# EAGLE design 2020-03-18 Buck Regulator (EAGLE 8.6.3)

## Sheet 1 of 4: Connectors
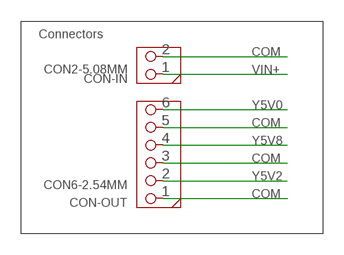
[diagram p0: schematic, sheet 1]

### Parts
CON-IN  CON2-5.08MM  [CON2-508]
CON-OUT  CON6-2.54MM  [CON6]

### Nets
COM: CON-IN.2 CON-OUT.1 CON-OUT.3 CON-OUT.5 ; also sheet 2,3,4
VIN+: CON-IN.1 ; also sheet 2
Y5V0: CON-OUT.6 ; also sheet 2,4
Y5V2: CON-OUT.2 ; also sheet 2,3
Y5V8: CON-OUT.4 ; also sheet 2,3,4

### Notes on the sheet
- Connectors

## Sheet 2 of 4: Protections
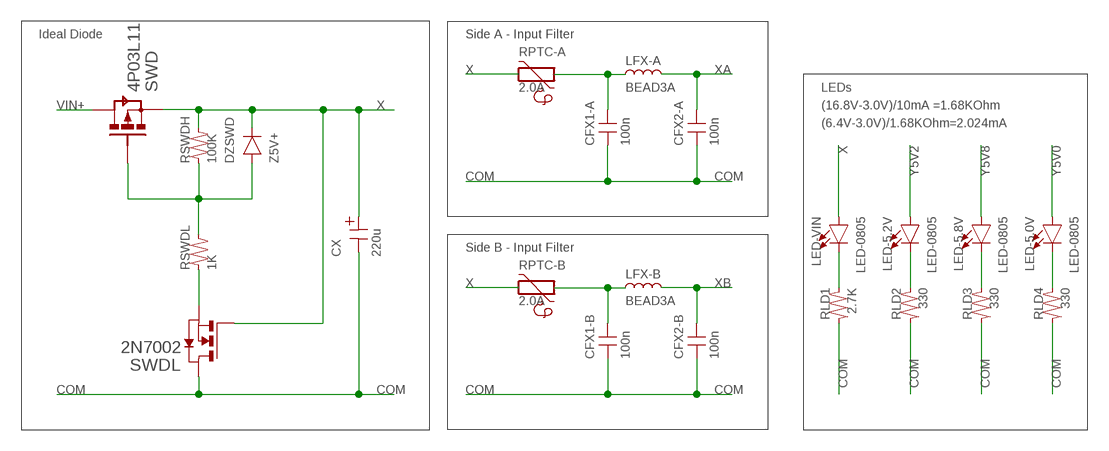
[diagram p1: schematic, sheet 2]

### Parts
CFX1-A  100n  C-0805  [SMD0805]
CFX1-B  100n  C-0805  [SMD0805]
CFX2-A  100n  C-0805  [SMD0805]
CFX2-B  100n  C-0805  [SMD0805]
CX  220u  C-POL-5.5MM  [CPOL-5MM5]
DZSWD  Z5V+  D-0805  [SMD0805-POL]
LED-5.0V  LED-0805  [SMD0805-POL]
LED-5.2V  LED-0805  [SMD0805-POL]
LED-5.8V  LED-0805  [SMD0805-POL]
LED-VIN  LED-0805  [SMD0805-POL]
LFX-A  BEAD3A  L-2.0X1.6  [SMD2MM0X1MM60]
LFX-B  BEAD3A  L-2.0X1.6  [SMD2MM0X1MM60]
RLD1  2.7K  R  [SMD0805]
RLD2  330  R  [SMD0805]
RLD3  330  R  [SMD0805]
RLD4  330  R  [SMD0805]
RPTC-A  2.0A  PTC-SMD0805  [M0805]
RPTC-B  2.0A  PTC-SMD0805  [M0805]
RSWDH  100K  R  [SMD0805]
RSWDL  1K  R  [SMD0805]
SWD  4P03L11  PMOSTO252  [TO252]
SWDL  2N7002  NMOS-SOT23  [SOT23]

### Nets
COM: CFX1-A.2 CFX1-B.2 CFX2-A.2 CFX2-B.2 CX.- RLD1.2 RLD2.2 RLD3.2 RLD4.2 SWDL.3(D) ; also sheet 1,3,4
N$1: CFX1-A.1 LFX-A.1 RPTC-A.2
N$2: DZSWD.+ RSWDH.1 RSWDL.2 SWD.1(G)
N$5: RSWDL.1 SWDL.2(S)
N$7: LED-VIN.- RLD1.1
N$8: LED-5.2V.- RLD2.1
N$10: LED-5.8V.- RLD3.1
N$11: LED-5.0V.- RLD4.1
N$13: CFX1-B.1 LFX-B.1 RPTC-B.2
VIN+: SWD.3(D) ; also sheet 1
X: CX.+ DZSWD.- LED-VIN.+ RPTC-A.1 RPTC-B.1 RSWDH.2 SWD.2(S) SWDL.1(G)
XA: CFX2-A.1 LFX-A.2 ; also sheet 3
XB: CFX2-B.1 LFX-B.2 ; also sheet 3
Y5V0: LED-5.0V.+ ; also sheet 1,4
Y5V2: LED-5.2V.+ ; also sheet 1,3
Y5V8: LED-5.8V.+ ; also sheet 1,3,4

### Notes on the sheet
- Ideal Diode | Side A - Input Filter
- LEDs
- (16.8V-3.0V)/10mA =1.68KOhm
- (6.4V-3.0V)/1.68KOhm=2.024mA
- Side B - Input Filter

## Sheet 3 of 4: Buck Regulator
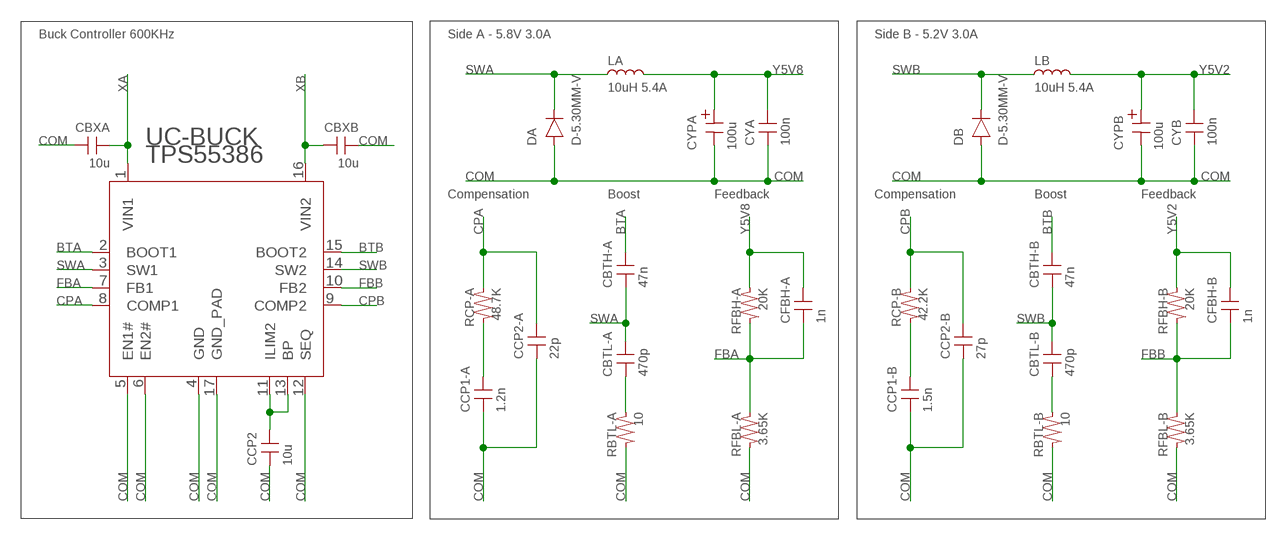
[diagram p2: schematic, sheet 3]

### Parts
CBTH-A  47n  C-0805  [SMD0805]
CBTH-B  47n  C-0805  [SMD0805]
CBTL-A  470p  C-0805  [SMD0805]
CBTL-B  470p  C-0805  [SMD0805]
CBXA  10u  C-1206  [SMD3MM2X1MM60]
CBXB  10u  C-1206  [SMD3MM2X1MM60]
CCP1-A  1.2n  C-0805  [SMD0805]
CCP1-B  1.5n  C-0805  [SMD0805]
CCP2  10u  C-1206  [SMD3MM2X1MM60]
CCP2-A  22p  C-0805  [SMD0805]
CCP2-B  27p  C-0805  [SMD0805]
CFBH-A  1n  C-0805  [SMD0805]
CFBH-B  1n  C-0805  [SMD0805]
CYA  100n  C-0805  [SMD0805]
CYB  100n  C-0805  [SMD0805]
CYPA  100u  C-POL-5.5MM  [CPOL-5MM5]
CYPB  100u  C-POL-5.5MM  [CPOL-5MM5]
DA  D-5.30MM-V  [THV-5MM30]
DB  D-5.30MM-V  [THV-5MM30]
LA  10uH 5.4A  L-12.8X12.8  [SMD12MM8X12MM8]
LB  10uH 5.4A  L-12.8X12.8  [SMD12MM8X12MM8]
RBTL-A  10  R  [SMD0805]
RBTL-B  10  R  [SMD0805]
RCP-A  48.7K  R  [SMD0805]
RCP-B  42.2K  R  [SMD0805]
RFBH-A  20K  R  [SMD0805]
RFBH-B  20K  R  [SMD0805]
RFBL-A  3.65K  R  [SMD0805]
RFBL-B  3.65K  R  [SMD0805]
UC-BUCK  TPS55386  [HTSSOP16]

### Nets
BTA: CBTH-A.1 UC-BUCK.2(BOOT1)
BTB: CBTH-B.1 UC-BUCK.15(BOOT2)
COM: CBXA.1 CBXB.2 CCP1-A.2 CCP1-B.2 CCP2-A.2 CCP2-B.2 CCP2.2 CYA.2 CYB.2 CYPA.- CYPB.- DA.+ DB.+ RBTL-A.2 RBTL-B.2 RFBL-A.2 RFBL-B.2 UC-BUCK.4(GND) UC-BUCK.5(EN1#) UC-BUCK.6(EN2#) UC-BUCK.12(SEQ) UC-BUCK.17(GND_PAD) ; also sheet 1,2,4
CPA: CCP2-A.1 RCP-A.1 UC-BUCK.8(COMP1)
CPB: CCP2-B.1 RCP-B.1 UC-BUCK.9(COMP2)
FBA: CFBH-A.2 RFBH-A.2 RFBL-A.1 UC-BUCK.7(FB1)
FBB: CFBH-B.2 RFBH-B.2 RFBL-B.1 UC-BUCK.10(FB2)
N$3: CBTL-A.2 RBTL-A.1
N$6: CCP2.1 UC-BUCK.11(ILIM2) UC-BUCK.13(BP)
N$9: CCP1-A.1 RCP-A.2
N$14: CCP1-B.1 RCP-B.2
N$15: CBTL-B.2 RBTL-B.1
SWA: CBTH-A.2 CBTL-A.1 DA.- LA.1 UC-BUCK.3(SW1)
SWB: CBTH-B.2 CBTL-B.1 DB.- LB.1 UC-BUCK.14(SW2)
XA: CBXA.2 UC-BUCK.1(VIN1) ; also sheet 2
XB: CBXB.1 UC-BUCK.16(VIN2) ; also sheet 2
Y5V2: CFBH-B.1 CYB.1 CYPB.+ LB.2 RFBH-B.1 ; also sheet 1,2
Y5V8: CFBH-A.1 CYA.1 CYPA.+ LA.2 RFBH-A.1 ; also sheet 1,2,4

### Notes on the sheet
- Buck Controller 600KHz | Side A - 5.8V 3.0A | Side B - 5.2V 3.0A
- Compensation | Boost | Feedback | Compensation | Boost | Feedback

## Sheet 4 of 4: LDO
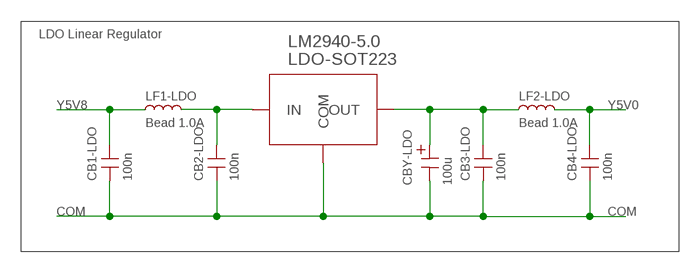
[diagram p3: schematic, sheet 4]

### Parts
CB1-LDO  100n  C-0805  [SMD0805]
CB2-LDO  100n  C-0805  [SMD0805]
CB3-LDO  100n  C-0805  [SMD0805]
CB4-LDO  100n  C-0805  [SMD0805]
CBY-LDO  100u  C-POL-5.5MM  [CPOL-5MM5]
LF1-LDO  Bead 1.0A  L-0805  [SMD0805]
LF2-LDO  Bead 1.0A  L-0805  [SMD0805]
LM2940-5.0  LDO-SOT223  [SOT223]

### Nets
COM: CB1-LDO.2 CB2-LDO.2 CB3-LDO.2 CB4-LDO.2 CBY-LDO.- LM2940-5.0.2(COM) LM2940-5.0.4(COM) ; also sheet 1,2,3
N$4: CB3-LDO.1 CBY-LDO.+ LF2-LDO.1 LM2940-5.0.3(OUT)
N$12: CB2-LDO.1 LF1-LDO.2 LM2940-5.0.1(IN)
Y5V0: CB4-LDO.1 LF2-LDO.2 ; also sheet 1,2
Y5V8: CB1-LDO.1 LF1-LDO.1 ; also sheet 1,2,3

### Notes on the sheet
- LDO Linear Regulator

## Library data of the parts
CB1-LDO CB2-LDO CB3-LDO CB4-LDO CBTH-A CBTH-B CBTL-A CBTL-B CBXA CBXB CCP1-A CCP1-B CCP2 CCP2-A CCP2-B CFBH-A CFBH-B CFX1-A CFX1-B CFX2-A CFX2-B CYA CYB = 2020-03-18-Lib:C: Standard Capacitor Non polarized capacitor
CBY-LDO CX CYPA CYPB = 2020-03-18-Lib:C-POL: Standard Polarized Capacitor
CON-IN = 2020-03-18-Lib:CON2: 2 pin screw connector
CON-OUT = 2020-03-18-Lib:CON6: Standard Connector 3 pin
DA DB DZSWD = 2020-03-18-Lib:D: Standard Diode Polarized Packages: >0805
LA LB LF1-LDO LF2-LDO LFX-A LFX-B = 2020-03-18-Lib:L: Standard Inductor
LED-5.0V LED-5.2V LED-5.8V LED-VIN = 2020-03-18-Lib:LED: Standard LED SMD0805 Polarized Package
LM2940-5.0 = 2020-03-18-Lib:LDO: LDO Three pins low dropout positive linear regulator Components: >LM2940
RBTL-A RBTL-B RCP-A RCP-B RFBH-A RFBH-B RFBL-A RFBL-B RLD1-RLD4 RSWDH RSWDL = 2020-03-18-Lib:R: Standard Resistor
RPTC-A RPTC-B = 2020-03-18-Lib:PTC: PTC Positive temperature coefficient resistor Resettable Fuse
SWD = 2020-03-18-Lib:PMOS
SWDL = 2020-03-18-Lib:NMOS: Standard NMOS
UC-BUCK = 2020-03-18-Lib:TPS55386: TPS55386 Dual Buck Regulator Number of channels: 2 Output current: 3A per channel Max Input voltage: 28V Frequency: 600KHz

## Net classes
0 default: clearance 0.2 mm

## Board
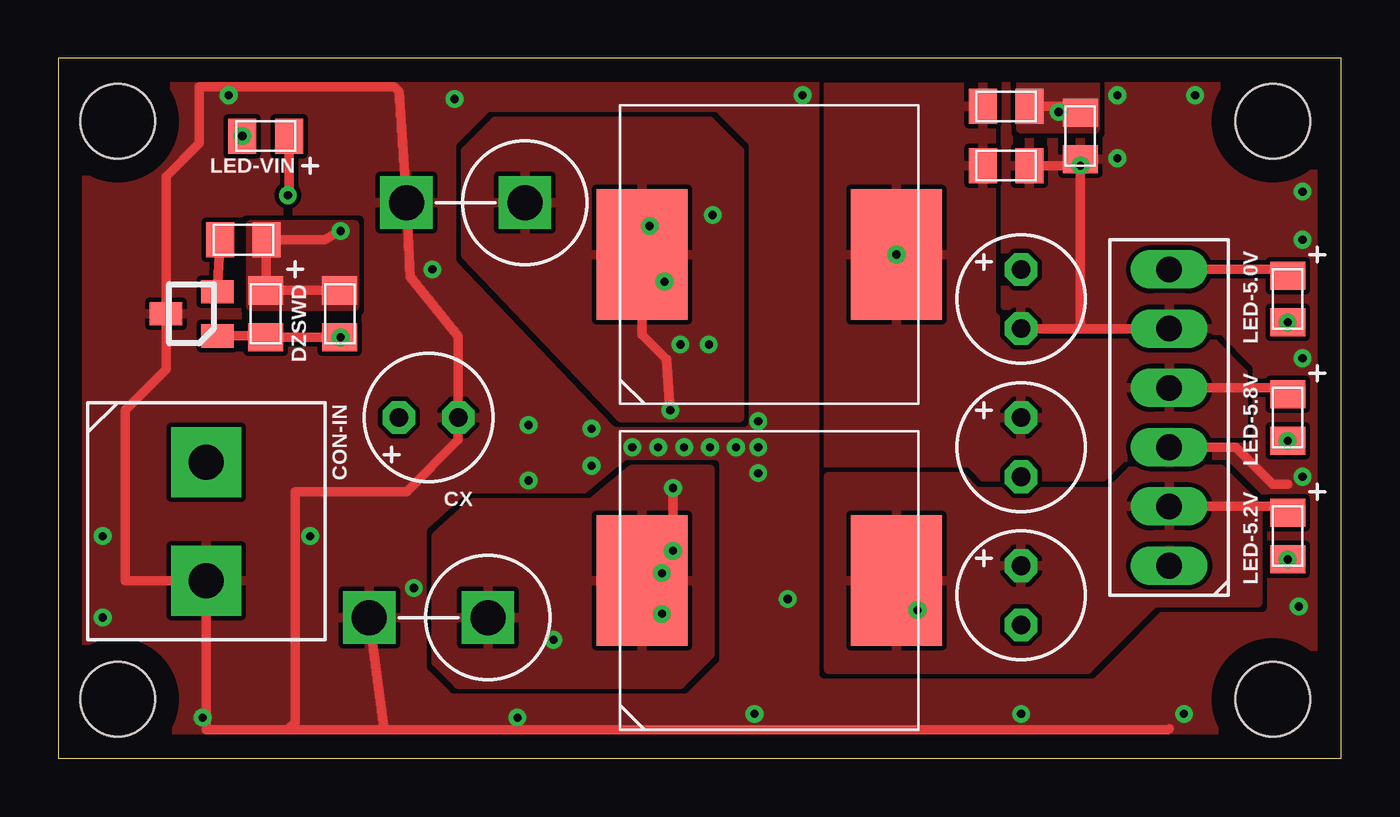
[diagram p4: board, top side]
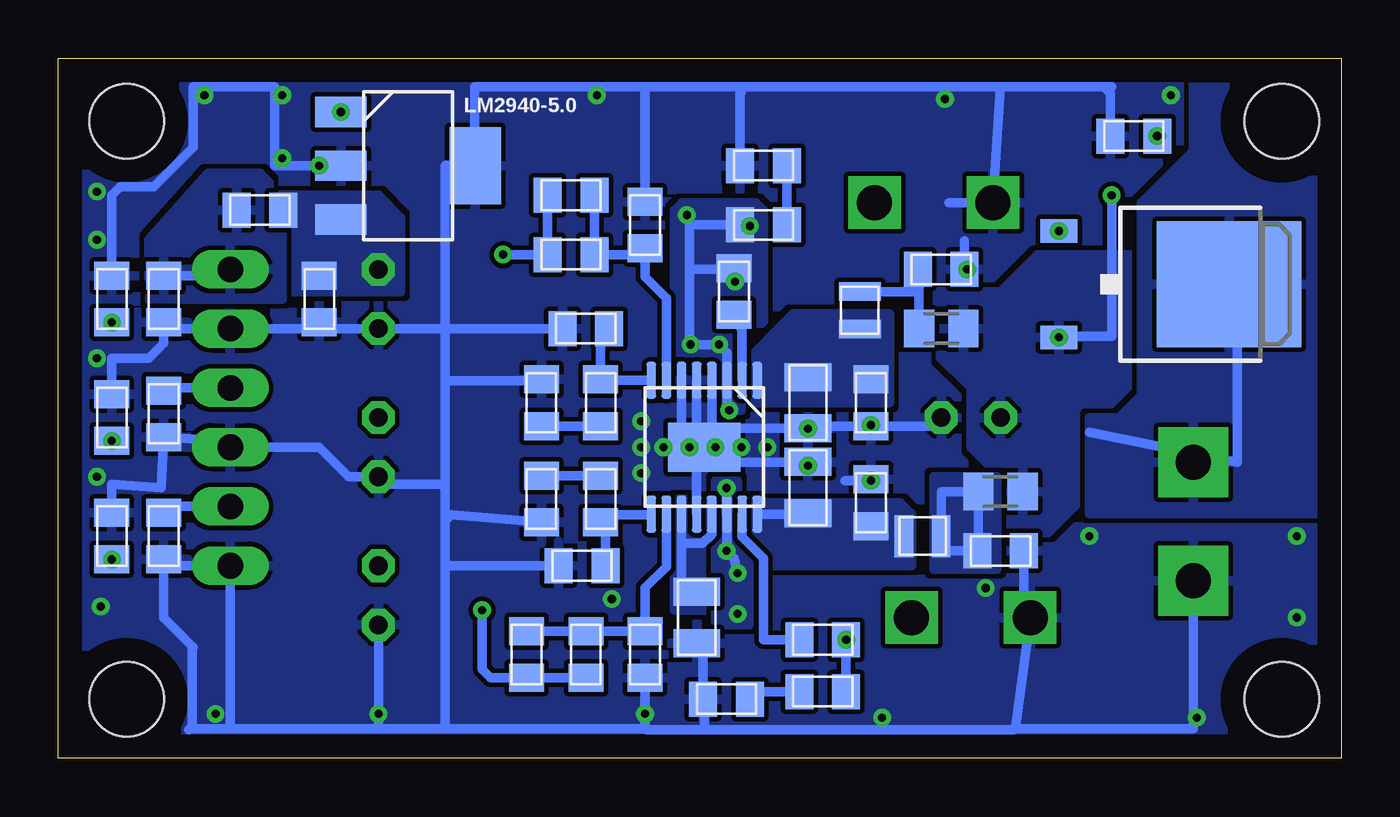
[diagram p5: board, bottom side, seen from below]

Size 55 x 30 mm. Coordinates in mm from the lower left corner, seen from the top.
Outline: 0,0 55,0 55,30 0,30 0,0
Copper layers (1*16): Top 0.035mm / dielectric 1.5mm / Bottom 0.035mm
Design rules "default *": minimum track width 6mil, minimum drill 0.35mm, track to track 6mil, track to pad 6mil, pad to pad 6mil, via to via 6mil, smd to smd 6mil, copper to edge 40mil, drill to drill 6mil, minimum pad ring 10mil, minimum via ring 8mil, stop-mask expansion 4mil, vias tented up to drill 0mil, thermal gap 0.2mm
Holes 3.2 mm at 2.54,2.54 2.54,27.3 52.07,2.54 52.07,27.3

### Footprints (pad centres in the part's own frame; a part is rotated, then mirrored left to right if it is on the bottom)
SMD0805 = smd 1.2 x 1.5: 1 -1,0; 2 1,0
SMD3MM2X1MM60 = smd 1.2 x 2: 1 -1.1,0; 2 1.1,0
CPOL-5MM5 = drill 0.8 pad 1.4 octagon: + 1.27,0; - -1.27,0
CON2-508 = drill 1.5 pad 3 square: 1 -2.54,0; 2 2.54,0
CON6 = drill 1.1 long: 1 -3.81,0; 2 -1.27,0; 3 1.27,0; 4 3.81,0; 5 6.35,0; 6 8.89,0
THV-5MM30 = drill 1.5 square: + 2.54,0; - -2.54,0
SMD0805-POL = smd 1.2 x 1.5: + -1,0; - 1,0
SMD12MM8X12MM8 = smd 5.6 x 3.9: 1 0,5.45; 2 0,-5.45
SMD2MM0X1MM60 = smd 0.8 x 1.8: 1 -0.8,0; 2 0.8,0
SOT223 = smd 1.3 x 2.2: 1 -2.3,-2.88; 2 0,-2.88; 3 2.3,-2.88 | smd 3.3 x 2.2: 4 0,2.88
M0805 = smd 1.3 x 1.6: 1 -0.95,0; 2 0.95,0
TO252 = smd 1 x 1.6: 1 -2.28,-4.8; 2 2.28,-4.8 | smd 5.4 x 6.2: 3 0,2.5
SOT23 = smd 1 x 1.4: 1 -0.95,-1.1; 2 0.95,-1.1; 3 0,1.1
HTSSOP16 = smd 1.57 x 0.41: 1 -2.87,2.275; 2 -2.87,1.625; 3 -2.87,0.975; 4 -2.87,0.325; 5 -2.87,-0.325; 6 -2.87,-0.975; 7 -2.87,-1.625; 8 -2.87,-2.275; 9 2.87,-2.275; 10 2.87,-1.625; 11 2.87,-0.975; 12 2.87,-0.325; 13 2.87,0.325; 14 2.87,0.975; 15 2.87,1.625; 16 2.87,2.275 | smd 2.105 x 3.115: 17 0,0

### Placement (x,y rotation side)
CB1-LDO  40.64,25.4 0 top
CB2-LDO  43.81,26.67 270 top
CB3-LDO  43.81,19.68 270 bottom
CB4-LDO  50.48,19.68 270 bottom
CBTH-A  26.04,20 90 bottom
CBTH-B  22.23,5.08 0 bottom
CBTL-A  24.77,22.86 0 bottom
CBTL-B  22.23,2.86 180 bottom
CBXA  22.86,15.24 90 bottom
CBXB  22.86,11.6 90 bottom
CBY-LDO  41.27,19.68 90 top
CCP1-A  34.29,15.24 90 bottom
CCP1-B  34.29,11.11 270 bottom
CCP2  27.62,6.03 270 bottom
CCP2-A  32.38,18.41 180 bottom
CCP2-B  32.54,8.26 180 bottom
CFBH-A  33.02,24.13 0 bottom
CFBH-B  34.92,4.45 90 bottom
CFX1-A  17.14,20.95 0 bottom
CFX1-B  14.61,8.89 0 bottom
CFX2-A  20.16,15.24 270 bottom
CFX2-B  20.16,10.95 90 bottom
CON-IN  6.35,10.16 270 top
CON-OUT  47.62,12.06 90 top
CX  15.88,14.61 180 top
CYA  50.48,14.76 270 bottom
CYB  50.48,9.53 270 bottom
CYPA  41.27,13.34 90 top
CYPB  41.27,6.99 90 top
DA  17.46,23.81 180 top
DB  15.88,6.03 180 top
DZSWD  8.89,19.05 270 top
LA  30.48,21.59 90 top
LB  30.48,7.62 90 top
LED-5.0V  52.7,19.68 270 top
LED-5.2V  52.7,9.53 270 top
LED-5.8V  52.7,14.61 270 top
LED-VIN  8.89,26.67 180 top
LF1-LDO  40.64,27.94 0 top
LF2-LDO  46.35,23.5 180 bottom
LFX-A  20.64,19.2 270 bottom
LFX-B  17.95,9.53 180 bottom
LM2940-5.0  40.01,25.4 270 bottom
RBTL-A  24.77,25.4 180 bottom
RBTL-B  26.35,2.54 180 bottom
RCP-A  31.75,15.24 270 bottom
RCP-B  31.75,11.11 90 bottom
RFBH-A  33.02,21.59 0 bottom
RFBH-B  32.38,4.45 90 bottom
RFBL-A  29.84,22.86 90 bottom
RFBL-B  29.84,4.45 270 bottom
RLD1  8.89,26.67 180 bottom
RLD2  52.7,9.53 90 bottom
RLD3  52.7,14.61 90 bottom
RLD4  52.7,19.68 90 bottom
RPTC-A  17.14,18.41 180 bottom
RPTC-B  14.61,11.43 180 bottom
RSWDH  12.06,19.05 270 top
RSWDL  7.94,22.23 0 top
SWD  7.3,20.32 270 bottom
SWDL  5.71,19.05 90 top
U$1  [SIGNATURE_ORANGEBOT_SMALL]  8.1,2.54 0 top
U$2  [SIGNATURE_ADROBOT_SMALL]  9.53,1.27 0 top
UC-BUCK  27.3,13.34 270 bottom

### Tracks (layer width: path | path; a pad name or v marks a point on that pad's centre or on a via)
BTA
  Bottom 0.4: UC-BUCK.2 25.68,18.33 CBTH-A.1
BTB
  Bottom 0.4: UC-BUCK.15 25.68,9.49 24.77,8.57 24.77,5.08 CBTH-B.1
COM  (via drill 0.35)
  Top 0.4: 9.84,1.22 6.35,1.22 CON-IN.2 2.86,7.62 2.86,14.92 4.62,16.68 SWDL.3 4.62,24.93 6.03,26.35 6.03,28.78 14.4,28.78 14.61,28.57 DA.+ 15.08,20.64 17.14,18.1 CX.- 17.14,13.65 14.92,11.43 10.16,11.43 10.16,1.53 9.84,1.22 | 9.84,1.22 13.97,1.22 | 13.97,1.22 47.57,1.22 47.62,1.27 | DB.+ 13.97,1.22 | CB1-LDO.2 v43.81,25.4 43.55,25.4 CB2-LDO.2 43.81,18.41 | CBY-LDO.- 43.81,18.41 | 43.81,18.41 CON-OUT.5 | CON-OUT.3 50.48,13.34 52.07,11.75 52.7,11.75
  Bottom 0.4: UC-BUCK.5 27.63,13.66 UC-BUCK.17 | UC-BUCK.4 26.98,13.97 | 26.98,13.97 26.98,13.66 UC-BUCK.17 | UC-BUCK.6 28.28,13.63 28.57,13.34 v27.94,13.34 | v27.94,13.34 UC-BUCK.17 | UC-BUCK.12 27.63,12.7 | 27.63,12.7 27.63,13.03 v27.94,13.34 | 26.98,13.97 26.81,14.14 CBXA.1 22.76,14.24 CFX2-A.2 17.51,14.24 CX.- | 27.63,12.7 CBXB.2 22.59,12.43 | RBTL-A.2 25.77,28.53 25.72,28.57 25.93,28.78 | 25.93,28.78 29.84,28.78 | 29.84,28.78 RFBL-A.2 | 29.84,28.78 37.15,28.78 37.15,25.42 | 37.15,25.42 LM2940-5.0.4 | 25.93,28.78 14.61,28.78 | 14.61,28.78 DA.+ 16.83,23.81 | 14.61,28.78 10.16,28.78 | 10.16,28.78 9.84,28.78 9.89,28.74 | CFX1-A.2 16.14,22.18 | RFBL-B.2 29.84,1.27 | 29.84,1.27 29.79,1.22 27.3,1.22 | 27.3,1.22 27.3,2.49 RBTL-B.2 27.35,4.66 CCP2.2 | 27.3,1.22 14.02,1.22 13.97,1.27 | 13.97,1.27 DB.+ 13.61,6.71 CFX1-B.2 | 13.97,1.27 6.35,1.27 CON-IN.2 | CCP2-B.2 38.42,8.26 | 38.42,8.26 38.42,1.27 | 38.42,1.27 29.84,1.27 | 38.42,1.27 41.27,1.27 | 41.27,1.27 CYPB.- | 41.27,1.27 47.62,1.27 | 47.62,1.27 CON-OUT.1 50.48,8.26 | 47.62,1.27 49.36,1.27 | 49.36,1.27 49.41,1.22 | 49.36,1.27 49.25,1.37 49.25,4.72 49.21,4.76 50.48,6.03 50.48,8.26 | 50.48,8.26 CYB.2 | 38.42,8.26 38.42,10.16 | 38.42,10.16 38.15,10.43 CCP1-B.2 | 38.42,10.16 38.42,11.75 | 38.42,11.75 40.96,11.75 CYPA.- 42.55,12.06 43.81,13.34 CON-OUT.3 47.9,13.61 CYA.2 50.59,11.59 52.7,11.75 RLD2.2 | 38.42,11.75 38.42,16.19 | 38.42,16.19 34.34,16.19 CCP1-A.2 | 38.42,16.19 38.42,18.41 | 38.42,18.41 CBY-LDO.- 44.18,18.41 44.31,18.55 | 38.42,18.41 CCP2-A.2 | 38.42,18.41 38.42,25.4 38.4,25.42 37.15,25.42 | 44.31,18.55 CB3-LDO.2 | 44.31,18.55 44.45,18.41 CON-OUT.5 50.21,18.41 CB4-LDO.2 50.48,17.78 51.12,17.14 52.7,17.14 RLD3.2
  Bottom 0.4: RLD4.2 52.7,24.13 52.35,24.49 50.9,24.49 49.21,26.18 49.21,28.78 45.72,28.78 45.72,25.4 v43.81,25.4 LM2940-5.0.2 | 10.16,28.78 9.89,28.51 RLD1.2 | CFX2-B.2 20.21,11.91 21.27,11.91
  other vias: 24.61,13.34 25.72,13.34 26.83,13.34 29.05,13.34 30,13.34 30,12.22 30,14.45 53.18,6.51 48.26,1.91 41.27,1.91 29.84,1.91 19.68,1.75 6.19,1.75 1.91,6.03 1.91,9.53 10.79,9.53 7.3,28.42 16.99,28.26 31.91,28.42 45.4,28.42 48.74,28.42 53.34,24.29 53.34,22.23 45.4,25.72 53.34,17.14 53.34,12.06 31.27,6.83 15.24,7.3 16.03,20.95 22.86,14.13 20.16,14.29 22.86,12.54 20.16,11.91
  pour Top (rank 6): 0,29.84 0,0 55.24,0 55.24,29.84
  pour Bottom (rank 6): 0,29.84 55.24,29.84 55.24,0 0,0
CPA
  Bottom 0.4: UC-BUCK.8 31.71,16.2 RCP-A.1 31.75,18.05 CCP2-A.1
CPB
  Bottom 0.4: UC-BUCK.9 29.61,10.43 31.11,10.43 | 31.11,10.43 RCP-B.1 | CCP2-B.1 31.54,10.16 31.11,10.43
FBA
  Bottom 0.4: UC-BUCK.7 28.93,19.72 29.84,20.64 RFBL-A.1 30.11,21.59 RFBH-A.2 CFBH-A.2
FBB
  Bottom 0.4: UC-BUCK.10 28.93,8.22 29.84,7.3 RFBL-B.1 RFBH-B.2 CFBH-B.2
N$1
  Bottom 0.4: RPTC-A.2 18.09,20 | 18.09,20 18.09,20.91 CFX1-A.1 | LFX-A.1 18.09,20
N$2  (via drill 0.35)
  Top 0.4: RSWDH.1 DZSWD.+ RSWDL.2 11.41,22.23 SWD.1
  other vias: 12.1,22.6
  pour Top (no thermals): 8.26,19.37 8.26,22.86 12.7,22.86 12.7,19.37
N$3
  Bottom 0.4: RBTL-A.1 CBTL-A.2
N$4
  pour Bottom (rank 2, no thermals): 40.32,20 40.32,23.18 41.27,24.13 46.04,24.13 46.04,22.86 45.09,21.91 45.09,20
N$5
  Top 0.4: SWDL.2 RSWDL.1
N$6
  Bottom 0.4: UC-BUCK.11 28.28,9.21 | 28.28,9.21 28.28,7.01 28.26,6.99 28.11,7.13 CCP2.1 | UC-BUCK.13 26.98,9.61 27.39,9.21 28.28,9.21
  pour Bottom (rank 3, no thermals): 26.83,6.35 26.83,10.95 26.99,11.11 28.57,11.11 28.57,6.35
N$7  (via drill 0.35)
  other vias: 7.89,26.67
N$8  (via drill 0.35)
  other vias: 52.7,8.53
N$9
  Bottom 0.4: RCP-A.2 CCP1-A.1
N$10  (via drill 0.35)
  other vias: 52.7,13.61
N$11  (via drill 0.35)
  other vias: 52.7,18.68
N$12  (via drill 0.35)
  Top 0.4: LF1-LDO.2 42.86,27.94 | 42.86,27.94 43.55,27.94 CB2-LDO.1 | v42.88,27.7 42.86,27.72 42.86,27.94
  pour Top (no thermals): 41.27,28.89 41.27,26.99 44.45,26.99 44.45,28.89
N$13
  Bottom 0.4: CFX1-B.1 15.55,8.94 RPTC-B.2 17.14,11.43 LFX-B.1 17.14,8.89 CFX1-B.1
  pour Bottom (no thermals): 14.76,8.1 14.76,12.06 17.46,12.06 17.46,8.1
N$14
  Bottom 0.4: RCP-B.2 CCP1-B.1
N$15
  Bottom 0.4: CBTL-B.2 25.04,2.86 RBTL-B.1
SWA  (via drill 0.35)
  Top 0.4: v26.23,14.92 26.07,17.11 25.03,18.15 LA.1
  Bottom 0.4: 27.94,20.95 27.94,17.78 v27.89,17.73 v26.67,17.73 26.33,17.39 UC-BUCK.3 26.33,15.22 26.04,14.92 26.07,14.92 v26.23,14.92 | 27.94,20.95 26.3,20.95 CBTH-A.2 | CBTL-A.1 27.94,22.86 27.94,20.95
  other vias: 28.05,23.29 25.35,22.81 25.99,20.43
  pour Top: 18.73,27.3 27.94,27.3 29.21,26.04 29.21,14.61 24.13,14.61 17.46,21.59 17.46,26.04
  pour Bottom (rank 2, no thermals): 25.08,16.83 24.77,17.14 24.77,23.5 25.08,23.81 28.26,23.81 28.57,23.5 28.57,17.14 28.26,16.83 26.35,14.92 25.72,14.92 24.77,15.88 24.77,16.51
SWB  (via drill 0.35)
  Top 0.4: v26.35,11.59 v26.35,8.89
  Bottom 0.4: v26.35,11.59 26.35,10.49 UC-BUCK.14 26.33,9.23 26.35,9.21 v26.35,8.89 26.04,8.57 v25.88,7.94 | CBTL-B.1 CBTH-B.2
  other vias: 21.23,5.08 25.88,6.19
  pour Top: 16.19,4.13 16.19,9.53 17.78,10.95 22.86,10.95 24.61,12.38 27.94,12.38 27.94,4.45 26.67,3.17 17.14,3.17
  pour Bottom (rank 2, no thermals): 25.88,11.91 26.83,11.91 26.83,5.71 25.4,5.71 25.4,9.21 25.72,9.53 25.88,9.53
VIN+
  Bottom 0.4: 10.79,13.97 4.45,12.7 4.45,20.28 SWD.3
  pour Bottom: 10.79,10.48 0.64,10.48 0.64,29.21 6.35,29.21 6.35,26.04 8.57,23.81 8.57,15.56 9.53,14.61 10.79,14.61
X  (via drill 0.35)
  Top 0.4: SWDL.1 8.84,18.1 DZSWD.- RSWDH.2 SWD.2 | LED-VIN.+ 9.89,24.18 v9.84,24.13
  Bottom 0.4: v9.84,24.13 9.84,18.1 12.04,18.1 SWD.2
  other vias: 12.1,18.04
  pour Bottom (rank 2): 8.26,13.97 8.26,21.59 13.02,21.59 14.61,20 17.3,20 17.3,17.3 15.88,15.88 15.88,13.34 15.08,12.54 15.08,9.53 12.7,9.53
XA
  pour Bottom (no thermals): 19.37,15.24 19.37,19.05 23.5,19.05 25.72,16.83 25.72,15.24
XB
  Bottom 0.4: UC-BUCK.16 22.89,10.46 CBXB.1
  pour Bottom (no thermals): 18.41,10.48 18.41,8.26 24.77,8.26 25.4,10 25.4,10.95 18.89,10.95
Y5V0
  Top 0.4: CON-OUT.6 52.44,20.95 LED-5.0V.+
  Bottom 0.4: CB4-LDO.1 47.9,20.68 CON-OUT.6
  pour Bottom: 45.4,19.68 45.4,24.13 46.35,25.08 48.58,25.08 51.12,22.23 51.12,19.68
Y5V2  (via drill 0.35)
  Top 0.4: CON-OUT.2 52.44,10.79 LED-5.2V.+ | LB.2 35.93,7.25 v36.83,6.35
  Bottom 0.4: RFBH-B.1 CFBH-B.1 36.47,3.44 36.83,3.81 v36.83,6.35 | CON-OUT.2 50.21,10.79 CYB.1
  pour Top: 33.02,3.81 33.02,12.06 38.73,12.06 39.37,11.43 45.09,11.43 46.04,12.38 49.85,12.38 51.44,10.79 51.44,6.67 46.99,6.67 44.13,3.81
Y5V8  (via drill 0.35)
  Top 0.4: CON-OUT.4 52.44,15.88 LED-5.8V.+
  Bottom 0.4: CFBH-A.1 RFBH-A.1 LA.2 | CON-OUT.4 50.21,15.88 CYA.1
  other vias: 35.93,21.59
  pour Top (rank 2): 33.02,12.06 33.02,29.21 40.01,29.21 40.01,19.05 41.27,17.78 49.53,17.78 50.8,16.51 50.8,13.97 48.9,12.06

### Text on the board
tTest: 2021-06-27 Dual Channel 3.0A Buck | Charged 4S = 16.8V / Discharged 2S = 6.4V | VIN+ | 5.2V 3.0A | 5.8V 3.0A | 5.0V 1.0A | VIN- | Orso Eric 2021 / OrangeBot